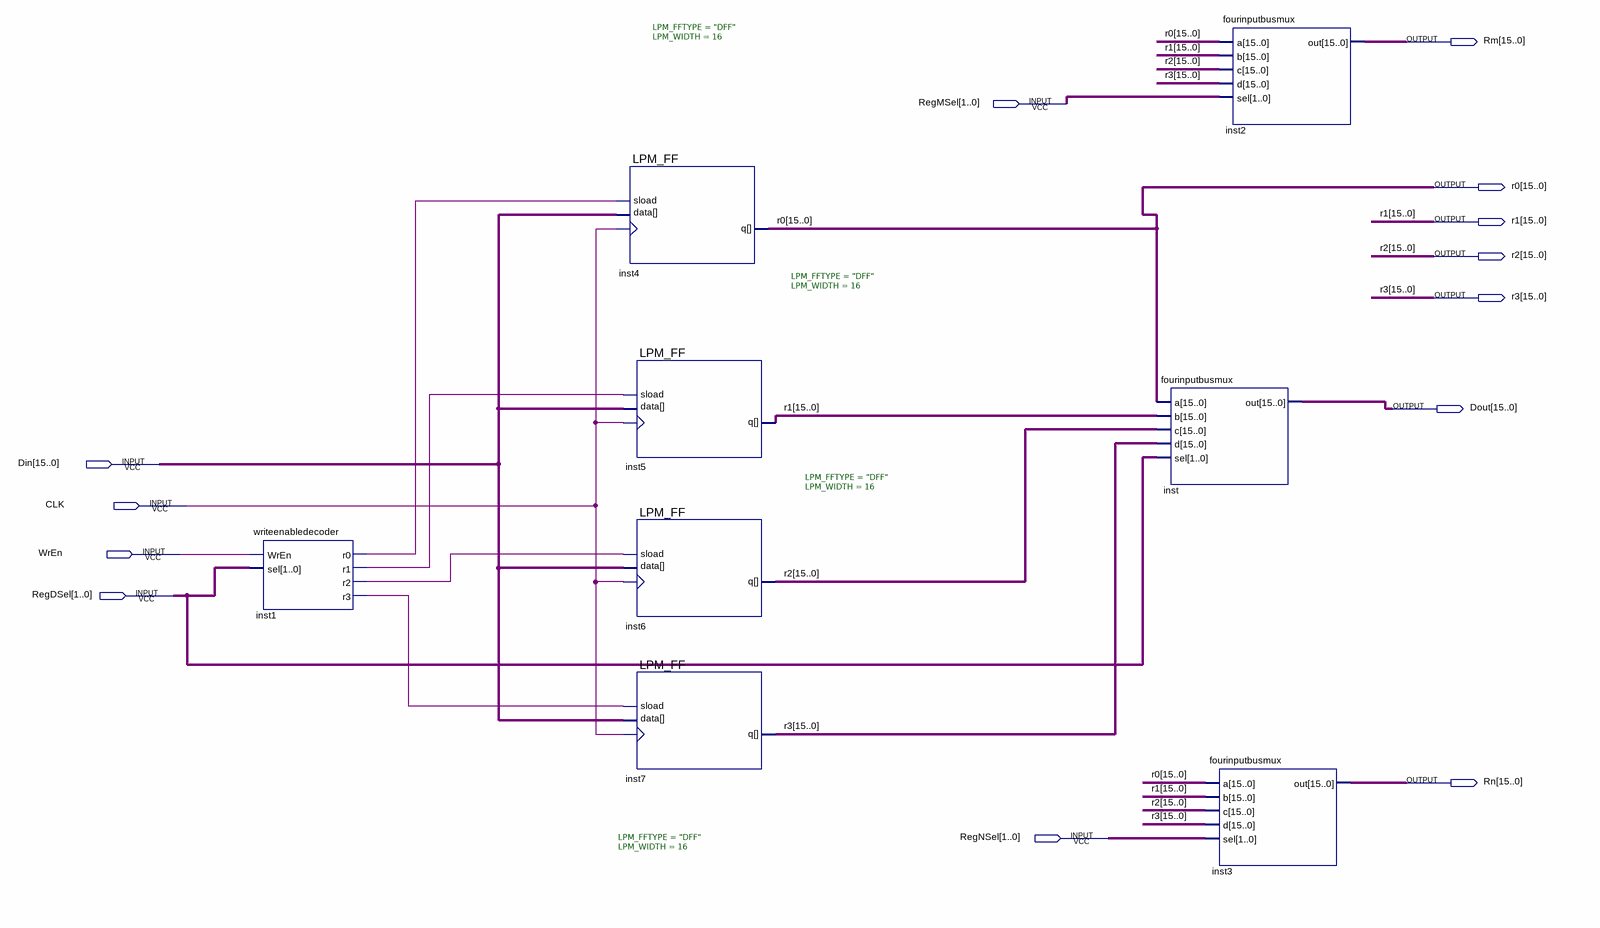
[diagram p0: schematic sheet]
// Quartus schematic Registers.bdf as structural Verilog: 8 symbols, 13 pins
module Registers (
  input  [1:0] RegMSel,
  input  [15:0] Din,
  input  CLK,
  input  WrEn,
  input  [1:0] RegDSel,
  input  [1:0] RegNSel,
  output [15:0] Rm,
  output [15:0] r0,
  output [15:0] r1,
  output [15:0] r2,
  output [15:0] r3,
  output [15:0] Dout,
  output [15:0] Rn
);

  wire inst1_r0, inst1_r1, inst1_r2, inst1_r3;

  writeenabledecoder inst1 (.WrEn(WrEn), .sel(RegDSel), .r0(inst1_r0), .r1(inst1_r1), .r2(inst1_r2), .r3(inst1_r3));
  LPM_FF #(.LPM_FFTYPE("DFF"), .LPM_WIDTH(16)) inst4 (.clock(CLK), .data(Din), .sload(inst1_r0), .q(r0));
  LPM_FF #(.LPM_FFTYPE("DFF"), .LPM_WIDTH(16)) inst5 (.clock(CLK), .data(Din), .sload(inst1_r1), .q(r1));
  LPM_FF #(.LPM_FFTYPE("DFF"), .LPM_WIDTH(16)) inst6 (.clock(CLK), .data(Din), .sload(inst1_r2), .q(r2));
  LPM_FF #(.LPM_FFTYPE("DFF"), .LPM_WIDTH(16)) inst7 (.clock(CLK), .data(Din), .sload(inst1_r3), .q(r3));
  fourinputbusmux inst (.a(r0), .b(r1), .c(r2), .d(r3), .sel(RegDSel), .out(Dout));
  fourinputbusmux inst2 (.a(r0), .b(r1), .c(r2), .d(r3), .sel(RegMSel), .out(Rm));
  fourinputbusmux inst3 (.a(r0), .b(r1), .c(r2), .d(r3), .sel(RegNSel), .out(Rn));
endmodule
